# Altium schematic sheet EndEffector-Support.SchDoc
size A4
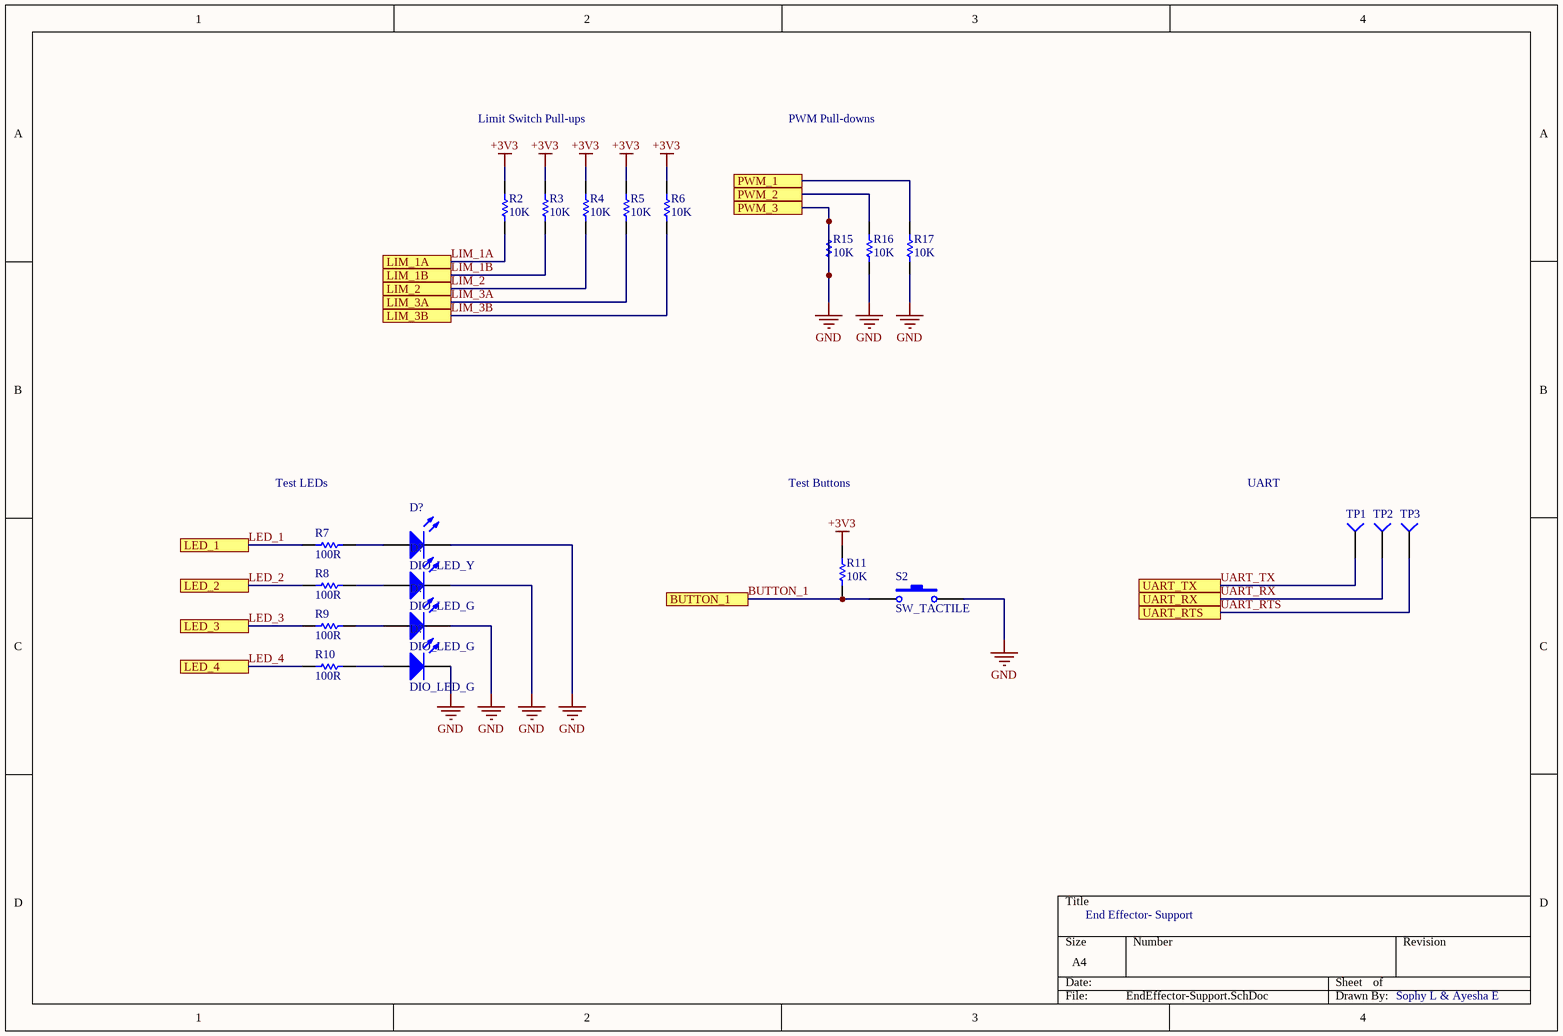
[diagram p0: EndEffector-Support.SchDoc]

## Parts
(Parts that share a designator on the sheet are numbered #1, #2 ... from top to bottom, then left to right.)
D?#1  DIO_LED_Y  [LED_0805]
D?#2  DIO_LED_G  [LED_0805]
D?#3  DIO_LED_G  [LED_0805]
D?#4  DIO_LED_G  [LED_0805]
R2  value 10K  [RESC0201(0603)_N]  (hidden comment: RES_10K_0603)
R3  value 10K  [RESC0201(0603)_N]  (hidden comment: RES_10K_0603)
R4  value 10K  [RESC0201(0603)_N]  (hidden comment: RES_10K_0603)
R5  value 10K  [RESC0201(0603)_N]  (hidden comment: RES_10K_0603)
R6  value 10K  [RESC0201(0603)_N]  (hidden comment: RES_10K_0603)
R7  value 100R  [RESC0201(0603)_N]  (hidden comment: RES_100R_0603)
R8  value 100R  [RESC0201(0603)_N]  (hidden comment: RES_100R_0603)
R9  value 100R  [RESC0201(0603)_N]  (hidden comment: RES_100R_0603)
R10  value 100R  [RESC0201(0603)_N]  (hidden comment: RES_100R_0603)
R11  value 10K  [RESC0201(0603)_N]  (hidden comment: RES_10K_0603)
R15  value 10K  [RESC0201(0603)_N]  (hidden comment: RES_10K_0603)
R16  value 10K  [RESC0201(0603)_N]  (hidden comment: RES_10K_0603)
R17  value 10K  [RESC0201(0603)_N]  (hidden comment: RES_10K_0603)
S2  SW_TACTILE  [SPST-2]
TP1  TESTPOINT  (value not drawn)
TP2  TESTPOINT  (value not drawn)
TP3  TESTPOINT  (value not drawn)

## Ports
BUTTON_1, LED_1, LED_2, LED_3, LED_4, LIM_1A, LIM_1B, LIM_2, LIM_3A, LIM_3B, PWM_1, PWM_2, PWM_3, UART_RTS, UART_RX, UART_TX

## Nets
+3V3: R2.2 R3.2 R4.2 R5.2 R6.2 R11.2
GND: D?#1.2(K) D?#2.2(K) D?#3.2(K) D?#4.2(K) R15.1 R15.2 R16.1 R17.1 S2.2 ; port PWM_3
BUTTON_1: R11.1 S2.1 ; port BUTTON_1
LED_1: R7.1 ; port LED_1
LED_2: R8.1 ; port LED_2
LED_3: R9.1 ; port LED_3
LED_4: R10.1 ; port LED_4
LIM_1A: R2.1 ; port LIM_1A
LIM_1B: R3.1 ; port LIM_1B
LIM_2: R4.1 ; port LIM_2
LIM_3A: R5.1 ; port LIM_3A
LIM_3B: R6.1 ; port LIM_3B
PWM_1: R17.2 ; port PWM_1
PWM_2: R16.2 ; port PWM_2
UART_RTS: TP3.1(=value) ; port UART_RTS
UART_RX: TP2.1(=value) ; port UART_RX
UART_TX: TP1.1(=value) ; port UART_TX
NetD?#1_1: D?#1.1(A) R7.2
NetD?#2_1: D?#2.1(A) R8.2
NetD?#3_1: D?#3.1(A) R9.2
NetD?#4_1: D?#4.1(A) R10.2

## Notes on the sheet
- Limit Switch Pull-ups
- PWM Pull-downs
- Test LEDs
- Test Buttons
- UART
- End Effector- Support
- Sophy L & Ayesha E

## Library data of the parts
D?#1 = DIO_LED_Y: LED YELLOW DIFFUSED 0805 SMD; Part Number: LY R976-PS-36; Manufacturer: OSRAM; Forward Voltage Drop: 2.2V; Package: 0805 (2012 Metric)
D?#2-D?#4 = DIO_LED_G: LED GREEN DIFFUSED 0805 SMD; Part Number: LG R971-KN-1; Manufacturer: OSRAM; Forward Voltage Drop: 2.2V; Package: 0805 (2012 Metric)
R2-R6 R11 R15-R17 = RES_10K_0603: RES SMD 10K OHM 5% 1/10W 0603; Manufacturer: Yageo; Part Number (MPN): RC0603JR-0710KL; Package: 0603 (1608 Metric); Dimensions: 0.063" L x 0.031" W (1.60mm x 0.80mm); Tolerance: 5%
R7-R10 = RES_100R_0603: RES SMD 100 OHM 1% 1/10W 0603; Manufacturer: Yageo; Part Number (MPN): RC0603FR-07100RL; Package: 0603 (1608 Metric); Dimensions: 0.063" L x 0.031" W (1.60mm x 0.80mm); Tolerance: 1%
S2 = SW_TACTILE: Switch; Published: 24-Mar-1999; LatestRevisionDate: 17-Jul-2002; LatestRevisionNote: Re-released for DXP Platform.; PackageReference: SPST-2; Publisher: Altium Limited; PackageDescription: Switch; 2 Leads